# Altium schematic sheet TopLevelMCU.SchDoc
size A3
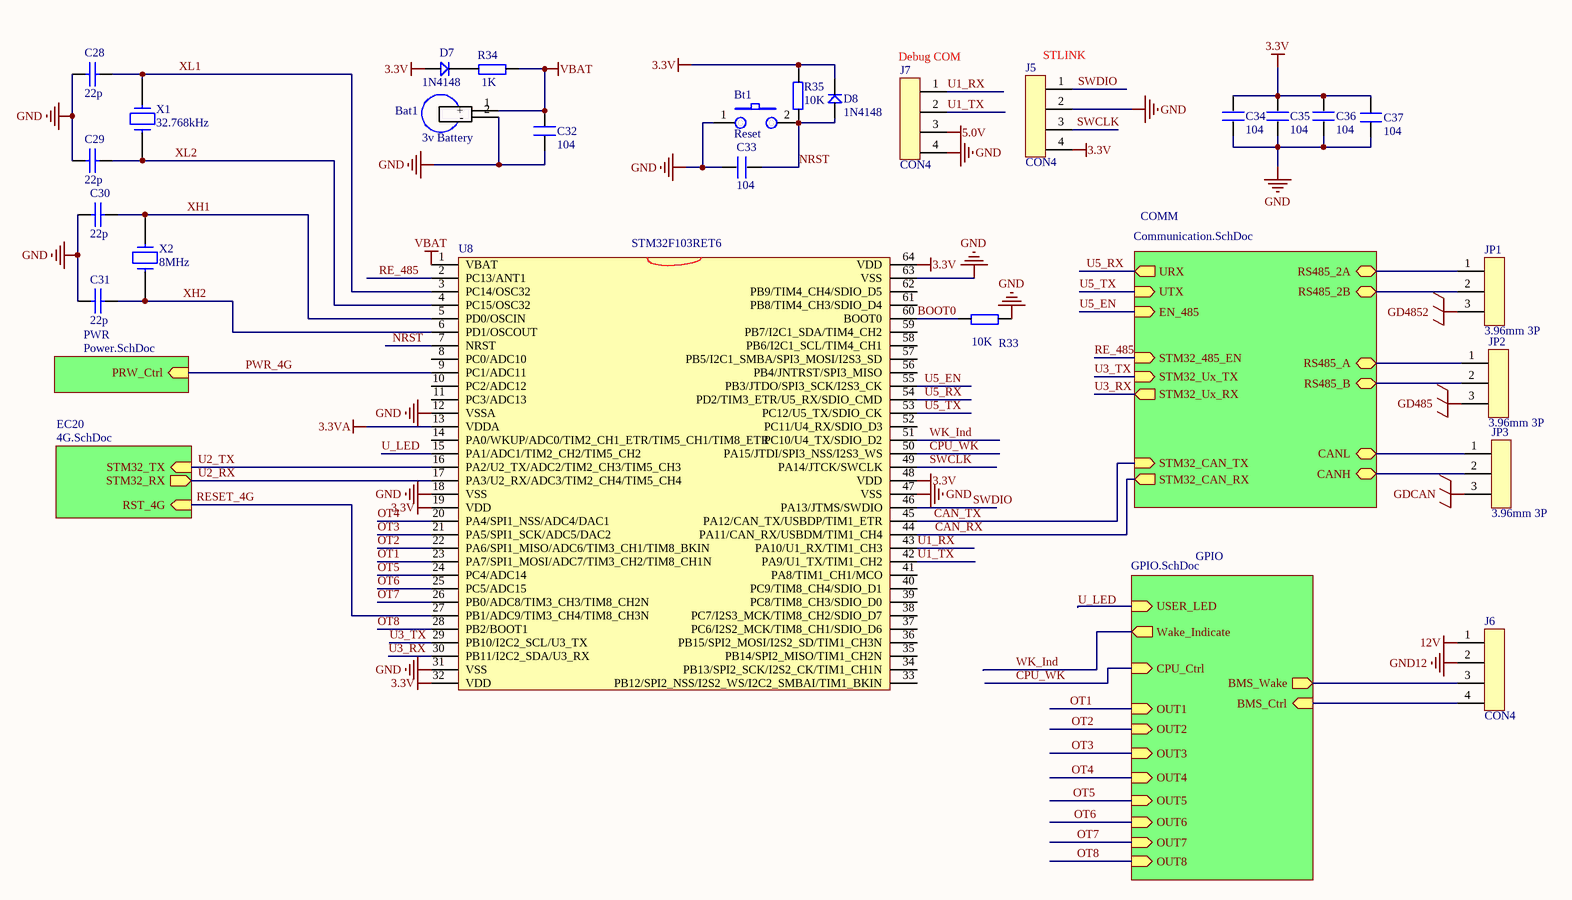
[diagram p0: TopLevelMCU.SchDoc]

## Parts
Bat1  3v Battery  [BATM]
Bt1  Reset  [3*6*2.5贴片 微动开关]
C28  22p  [0603_C]
C29  22p  [0603_C]
C30  22p  [0603_C]
C31  22p  [0603_C]
C32  104  [0603_C]
C33  104  [0603_C]
C34  104  [0603_C]
C35  104  [0603_C]
C36  104  [0603_C]
C37  104  [0603_C]
D7  1N4148  [SOD-323]
D8  1N4148  [SOD-323]
J5  CON4  [CON4(2.54)]
J6  CON4  [CON4(2.54)]
J7  CON4  [CON4(2.54)]
JP1  3.96mm 3P
JP2  3.96mm 3P
JP3  3.96mm 3P
R33  10K  [0603_R]
R34  1K  [0603_R]
R35  10K  [0603_R]
U8  STM32F103RET6  [LQFP64]
X1  32.768kHz  [XTAL32]
X2  8MHz  [Crystal_SMD]

## Sub-sheets
COMM = Communication.SchDoc: STM32_485_EN (in), STM32_Ux_TX (in), STM32_Ux_RX (out), STM32_CAN_TX (in), CANH (bidir), RS485_B (bidir), CANL (bidir), RS485_A (bidir), STM32_CAN_RX (out), RS485_2A (bidir), RS485_2B (bidir), UTX (in), EN_485 (in), URX (out)
EC20 = 4G.SchDoc: STM32_RX (out), STM32_TX (in), RST_4G (in)
GPIO = GPIO.SchDoc: BMS_Ctrl (in), BMS_Wake (out), USER_LED (in), CPU_Ctrl (in), Wake_Indicate (out), OUT1 (in), OUT2 (in), OUT3 (in), OUT4 (in), OUT5 (in), OUT6 (in), OUT7 (in), OUT8 (in)
PWR = Power.SchDoc: PRW_Ctrl (in)

## Nets
3.3V: C34.1 C35.1 C36.1 C37.1 D7.1 D8.2 J5.4 R35.1 U8.19(VDD) U8.32(VDD) U8.48(VDD) U8.64(VDD)
3.3VA: U8.13(VDDA)
5.0V: J7.3
12V: J6.1
GD485: JP2.3
GD4852: JP1.3
GDCAN: JP3.3
GND: Bat1.2(-) Bt1.1 C28.2 C29.2 C30.2 C31.2 C32.2 C33.2 C34.2 C35.2 C36.2 C37.2 J5.2 J7.4 R33.2 U8.12(VSSA) U8.18(VSS) U8.31(VSS) U8.47(VSS) U8.63(VSS)
GND12: J6.2
VBAT: Bat1.1(+) C32.1 R34.2 U8.1(VBAT)
BOOT0: R33.1 U8.60(BOOT0)
CAN_RX: U8.44(PA11/CAN_RX/USBDM/TIM1_CH4) ; sheet COMM/STM32_CAN_RX
CAN_TX: U8.45(PA12/CAN_TX/USBDP/TIM1_ETR) ; sheet COMM/STM32_CAN_TX
CPU_WK: U8.50(PA15/JTDI/SPI3_NSS/I2S3_WS) ; sheet GPIO/CPU_Ctrl
NRST: Bt1.2 C33.1 D8.1 R35.2 U8.7(NRST)
OT1: U8.23(PA7/SPI1_MOSI/ADC7/TIM3_CH2/TIM8_CH1N) ; sheet GPIO/OUT1
OT2: U8.22(PA6/SPI1_MISO/ADC6/TIM3_CH1/TIM8_BKIN) ; sheet GPIO/OUT2
OT3: U8.21(PA5/SPI1_SCK/ADC5/DAC2) ; sheet GPIO/OUT3
OT4: U8.20(PA4/SPI1_NSS/ADC4/DAC1) ; sheet GPIO/OUT4
OT5: U8.24(PC4/ADC14) ; sheet GPIO/OUT5
OT6: U8.25(PC5/ADC15) ; sheet GPIO/OUT6
OT7: U8.26(PB0/ADC8/TIM3_CH3/TIM8_CH2N) ; sheet GPIO/OUT7
OT8: U8.28(PB2/BOOT1) ; sheet GPIO/OUT8
PWR_4G: U8.9(PC1/ADC11) ; sheet PWR/PRW_Ctrl
RE_485: U8.2(PC13/ANT1) ; sheet COMM/STM32_485_EN
RESET_4G: U8.27(PB1/ADC9/TIM3_CH4/TIM8_CH3N) ; sheet EC20/RST_4G
SWCLK: J5.3 U8.49(PA14/JTCK/SWCLK)
SWDIO: J5.1 U8.46(PA13/JTMS/SWDIO)
U1_RX: J7.1 U8.43(PA10/U1_RX/TIM1_CH3)
U1_TX: J7.2 U8.42(PA9/U1_TX/TIM1_CH2)
U2_RX: U8.17(PA3/U2_RX/ADC3/TIM2_CH4/TIM5_CH4) ; sheet EC20/STM32_RX
U2_TX: U8.16(PA2/U2_TX/ADC2/TIM2_CH3/TIM5_CH3) ; sheet EC20/STM32_TX
U3_RX: U8.30(PB11/I2C2_SDA/U3_RX) ; sheet COMM/STM32_Ux_RX
U3_TX: U8.29(PB10/I2C2_SCL/U3_TX) ; sheet COMM/STM32_Ux_TX
U5_EN: U8.55(PB3/JTDO/SPI3_SCK/I2S3_CK) ; sheet COMM/EN_485
U5_RX: U8.54(PD2/TIM3_ETR/U5_RX/SDIO_CMD) ; sheet COMM/URX
U5_TX: U8.53(PC12/U5_TX/SDIO_CK) ; sheet COMM/UTX
U_LED: U8.15(PA1/ADC1/TIM2_CH2/TIM5_CH2) ; sheet GPIO/USER_LED
WK_Ind: U8.51(PC10/U4_TX/SDIO_D2) ; sheet GPIO/Wake_Indicate
XH1: C30.1 U8.5(PD0/OSCIN) X2.1
XH2: C31.1 U8.6(PD1/OSCOUT) X2.2
XL1: C28.1 U8.3(PC14/OSC32) X1.1
XL2: C29.1 U8.4(PC15/OSC32) X1.2
NetD7_2: D7.2 R34.1
NetJ6_3: J6.3 ; sheet GPIO/BMS_Wake
NetJ6_4: J6.4 ; sheet GPIO/BMS_Ctrl
NetJP1_1: JP1.1 ; sheet COMM/RS485_2A
NetJP1_2: JP1.2 ; sheet COMM/RS485_2B
NetJP2_1: JP2.1 ; sheet COMM/RS485_A
NetJP2_2: JP2.2 ; sheet COMM/RS485_B
NetJP3_1: JP3.1 ; sheet COMM/CANL
NetJP3_2: JP3.2 ; sheet COMM/CANH

Not connected (* = marked no-connect by the designer): U8 8(PC0/ADC10) 10(PC2/ADC12) 11(PC3/ADC13) 14(PA0/WKUP/ADC0/TIM2_CH1_ETR/TIM5_CH1/TIM8_ETR) 33(PB12/SPI2_NSS/I2S2_WS/I2C2_SMBAI/TIM1_BKIN) 34(PB13/SPI2_SCK/I2S2_CK/TIM1_CH1N) 35(PB14/SPI2_MISO/TIM1_CH2N) 36(PB15/SPI2_MOSI/I2S2_SD/TIM1_CH3N) 37(PC6/I2S2_MCK/TIM8_CH1/SDIO_D6) 38(PC7/I2S3_MCK/TIM8_CH2/SDIO_D7) 39(PC8/TIM8_CH3/SDIO_D0) 40(PC9/TIM8_CH4/SDIO_D1) 41(PA8/TIM1_CH1/MCO) 52(PC11/U4_RX/SDIO_D3) 56(PB4/JNTRST/SPI3_MISO) 57(PB5/I2C1_SMBA/SPI3_MOSI/I2S3_SD) 58(PB6/I2C1_SCL/TIM4_CH1) 59(PB7/I2C1_SDA/TIM4_CH2) 61(PB8/TIM4_CH3/SDIO_D4) 62(PB9/TIM4_CH4/SDIO_D5)

## Notes on the sheet
- (near J7) Debug COM
- (near J5) STLINK

## Library data of the parts
Bat1 = MS621FE
Bt1 = PUSH BUTTON
C28-C31 = CAP: Capacitor
C32-C37 = C
D7 D8 = D
JP1-JP3 = CON3
R33-R35 = R
U8 = STM32F103RDT6
X1 X2 = Crystal2